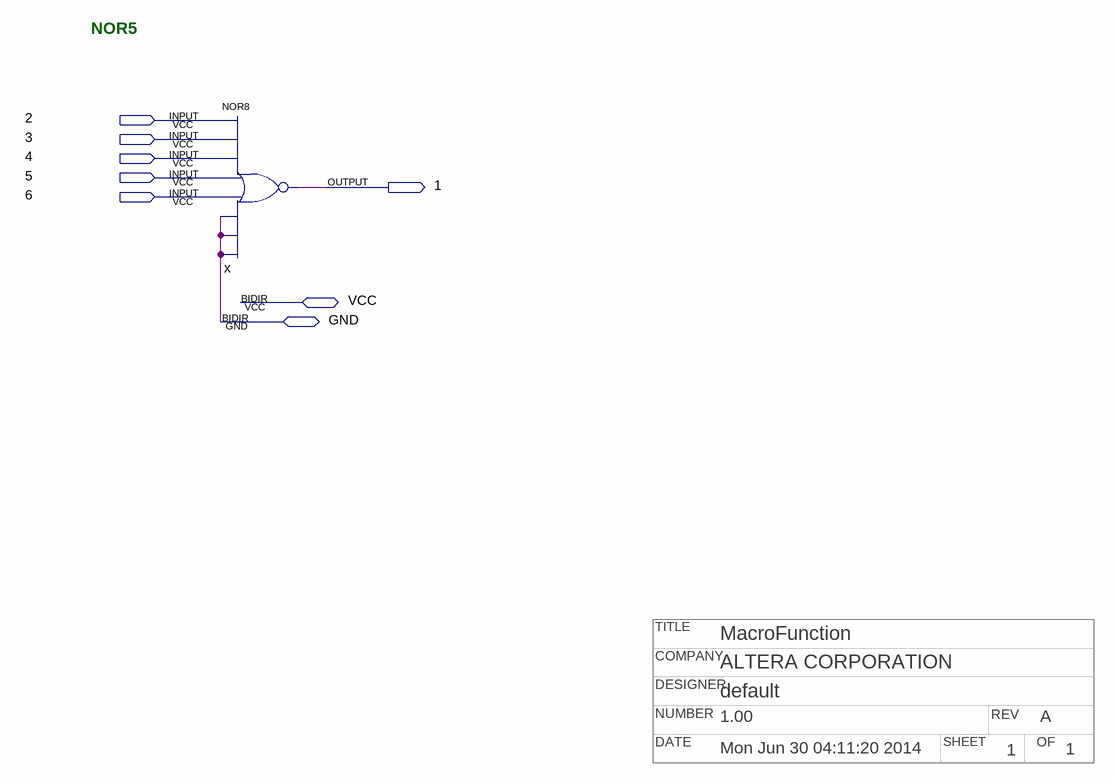
[diagram p0: schematic sheet]
// Quartus schematic npnor5.bdf as structural Verilog: 1 symbols, 8 pins
// Title block: TITLE: MacroFunction; COMPANY: ALTERA CORPORATION; DESIGNER: default; NUMBER: 1.00; REV: A; DATE: Mon Jun 30 04:11:20 2014; SHEET: 1; OF: 1
module npnor5 (
  input  \2 ,
  input  \3 ,
  input  \4 ,
  input  \5 ,
  input  \6 ,
  inout  VCC,
  inout  GND,
  output \1 
);

  nor x (\1 , \2 , \3 , \4 , \5 , \6 , GND, GND, GND);

  // Notes on the sheet:
  //   NOR5
endmodule
